# Altium schematic sheet supply.SchDoc
size 420 x 297 mm; SheetNumber: 4; SheetTotal: 5
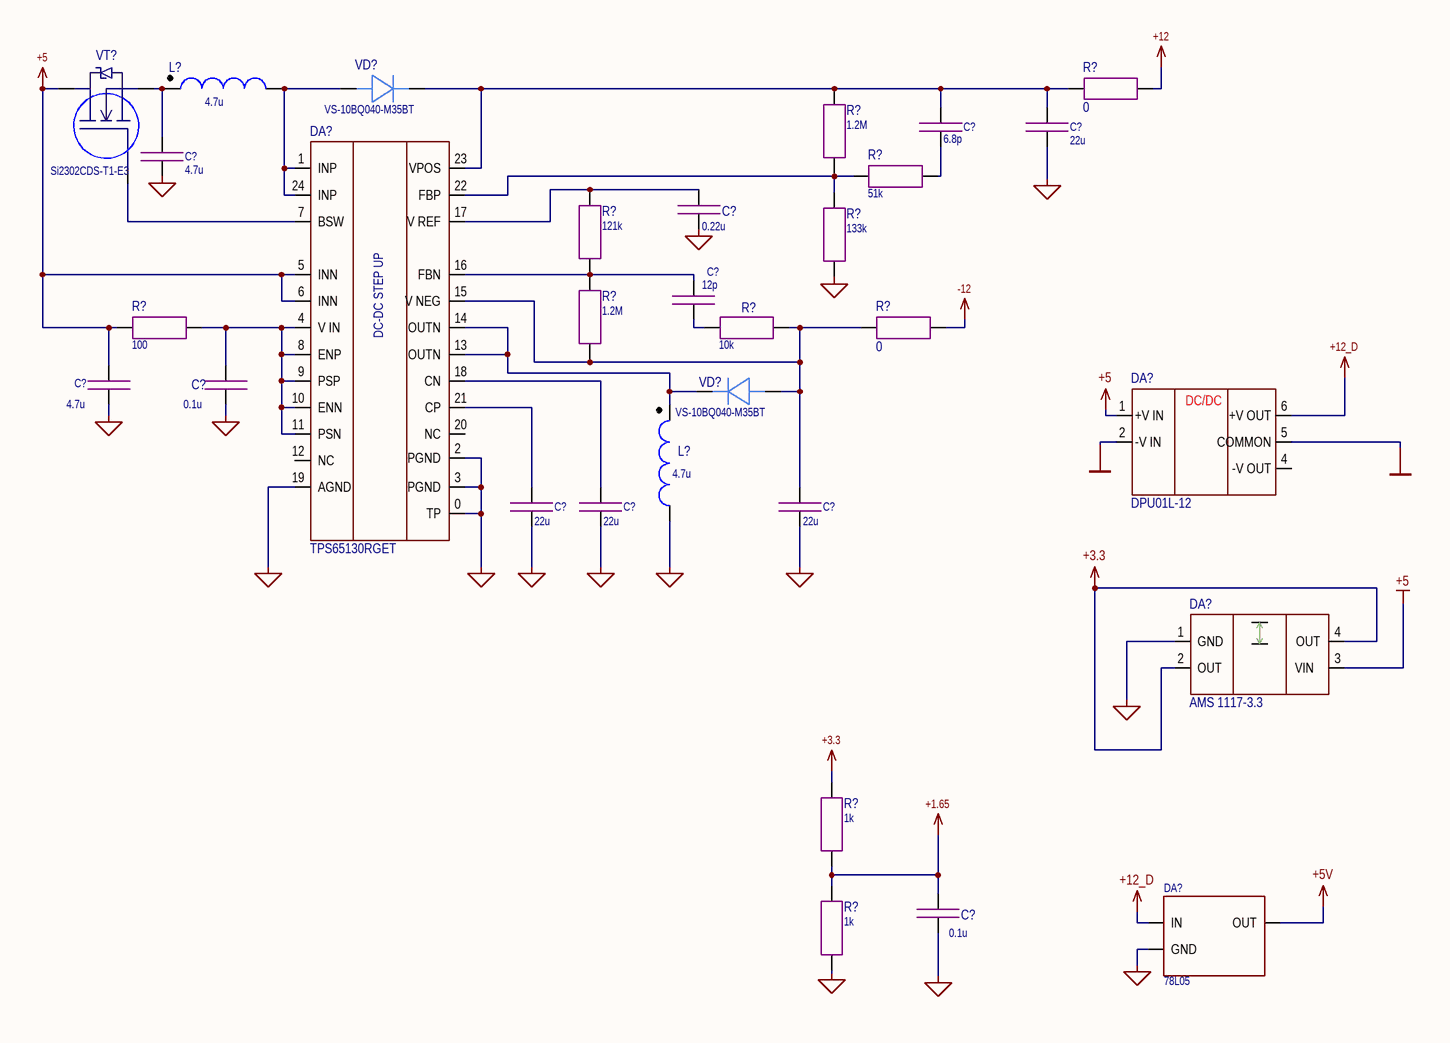
[diagram p0: supply.SchDoc]

## Parts
(Parts that share a designator on the sheet are numbered #1, #2 ... from top to bottom, then left to right.)
C?#1  6.8p  [CAP: SMD 0805 MD IPC 782]
C?#2  22u  [CAP: SMD 0805 MD IPC 782]
C?#3  4.7u  [CAP: SMD 0805 MD IPC 782]
C?#4  0.22u  [CAP: SMD 0805 MD IPC 782]
C?#5  12p  [CAP: SMD 0603 MD IPC 782]
C?#6  4.7u  [CAP: SMD 0805 MD IPC 782]
C?#7  0.1u  [CAP: SMD 0805 MD IPC 782]
C?#8  22u  [CAP: SMD 0805 MD IPC 782]
C?#9  22u  [CAP: SMD 0805 MD IPC 782]
C?#10  22u  [CAP: SMD 0805 MD IPC 782]
C?#11  0.1u  [CAP: SMD 0805 MD IPC 782]
DA?#1  TPS65130RGET  [IC: PVQFN 24]
DA?#2  DPU01L-12  [SIP-6]
DA?#3  AMS 1117-3.3  [IC: SOT 223]
DA?#4  78L05  [IC: SOT 89]
L?#1  4.7u  [IND: LPS5030]
L?#2  4.7u  [IND: LPS5030]
R?#1  0  [RES: SMD 0805 MD IPC 782]
R?#2  1.2M  [RES: SMD 0603 MD IPC 782]
R?#3  51k  [RES: SMD 0805 MD IPC 782]
R?#4  121k  [RES: SMD 0603 MD IPC 782]
R?#5  133k  [RES: SMD 0603 MD IPC 782]
R?#6  100  [RES: SMD 0805 MD IPC 782]
R?#7  10k  [RES: SMD 0805 MD IPC 782]
R?#8  0  [RES: SMD 0805 MD IPC 782]
R?#9  1.2M  [RES: SMD 0603 MD IPC 782]
R?#10  1k  [RES: SMD 0805 MD IPC 782]
R?#11  1k  [RES: SMD 0805 MD IPC 782]
VD?#1  VS-10BQ040-M35BT  [DIODE: SMB]
VD?#2  VS-10BQ040-M35BT  [DIODE: SMB]
VT?  Si2302CDS-T1-E3  [IC: SOT 23]

## Nets
+1.65: C?#11.1 R?#10.1 R?#11.2
+3.3: DA?#3.2(OUT) DA?#3.4(OUT) R?#10.2
+5: C?#6.1 DA?#1.5(INN) DA?#1.6(INN) DA?#2.1(+V_IN) DA?#3.3(VIN) R?#6.1 VT?.3
+5V: DA?#4.1(OUT)
+12: R?#1.2
+12_D: DA?#2.6(+V_OUT) DA?#4.3(IN)
-12: R?#8.2
GNDD: DA?#2.2(-V_IN) DA?#2.5(COMMON)
NetC?#2_2: C?#2.2 C?#3.2 C?#4.2 C?#6.2 C?#7.2 C?#8.2 C?#9.2 C?#10.2 C?#11.2 DA?#1.0(TP) DA?#1.2(PGND) DA?#1.3(PGND) DA?#1.19(AGND) DA?#3.1(GND) DA?#4.2(GND) L?#2.2 R?#5.1 R?#11.1
NetC?#1_1: C?#1.1 C?#2.1 DA?#1.23(VPOS) R?#1.1 R?#2.2 VD?#1.1
NetC?#1_2: C?#1.2 R?#3.2
NetC?#3_1: C?#3.1 L?#1.1 VT?.2
NetC?#4_1: C?#4.1 DA?#1.17(V_REF) R?#4.2
NetC?#5_1: C?#5.1 DA?#1.16(FBN) R?#4.1 R?#9.2
NetC?#5_2: C?#5.2 R?#7.1
NetC?#7_1: C?#7.1 DA?#1.4(V_IN) DA?#1.8(ENP) DA?#1.9(PSP) DA?#1.10(ENN) DA?#1.11(PSN) R?#6.2
NetC?#8_1: C?#8.1 DA?#1.21(CP)
NetC?#9_1: C?#9.1 DA?#1.18(CN)
NetC?#10_1: C?#10.1 DA?#1.15(V_NEG) R?#7.2 R?#8.1 R?#9.1 VD?#2.2
NetDA?#1_1: DA?#1.1(INP) DA?#1.24(INP) L?#1.2 VD?#1.2
NetDA?#1_7: DA?#1.7(BSW) VT?.1
NetDA?#1_13: DA?#1.13(OUTN) DA?#1.14(OUTN) L?#2.1 VD?#2.1
NetDA?#1_22: DA?#1.22(FBP) R?#2.1 R?#3.1 R?#5.2

Not connected (* = marked no-connect by the designer): DA?#1 12(NC) 20(NC); DA?#2 4(-V_OUT)

## Notes on the sheet
- Подп. и дата
- Инв. № дубл.
- Взам. инв. №
- Инв. № подл.
- Изм.
- Лист
- № докум.
- Подп.
- Дата
- 2.106-A3
- Копировал
- Формат А3
- (in symbol DC-DC: 3-15/-15V TPS65130RGET) DC-DC STEP UP
- (in symbol DC-DC: +12/-12V DPU01L-12) DC/DC

## Library data of the parts
C?#1 = 6.8p 50V 0805 ±5%: Code: 6219233221; Name: Конденсатор COG 16V 6.8pF±5% 0805
C?#2 C?#8-C?#10 = 22u 35V 0805 ±20%: Code: 6279375691; Name: Конденсатор X5R 35V 22uF±20% 0805
C?#3 C?#6 = 4.7u 25V 0805 ±10%: Code: 6270000501; Name: Конденсатор X7R 25V 4,7uF±10% 0805
C?#4 = 0.22u 50V 0805 ±10%: Name: Конденсатор 0805B224K500NT, Fenghua
C?#5 = 12p 50V 0603 ±5%: Code: 6279238291; Name: Конденсатор NP0 50V 12pF±5% 0603
C?#7 C?#11 = 0.1u 50V 0805 ±10%: Code: 6279254871; Name: Конденсатор X7R 50V 0,1uF ±10% 0805
DA?#1 = DC-DC: 3-15/-15V TPS65130RGET: Code: 6339113561; Name: Микросхема TPS65130RGET, TI
DA?#2 = DC-DC: +12/-12V DPU01L-12: Code: 6339113551; Name: Микросхема AM2D-0512DZ, AIMTEC
DA?#3 = LDO: 15-3.3V AMS1117: Code: 6339112951; Name: Микросхема AMS-1117-3.3
DA?#4 = 78L05: 78L05, Стабилизатор напряжения +5В 0.1А; P/N: Микросхема питания 78L05, UMW; ComponentLink1Description: Chipdip; ComponentLink1URL: https://www.chipdip.ru/product/78l05-stabilizator-napryazheniya-5v-0.1a-sot-89-umw-9001231082
L?#1 L?#2 = 4.7u±20% 2A: LPS5030; Code: 6339119781; Name: Микросхема LPS5030-472MR(B), Coilcraft
R?#1 R?#8 = 0 ±1% 0805: Code: 6094342239; Name: Резистор 0R ±1% 0805
R?#2 R?#9 = 1.2M ±1% 0603: Code: 6069194591; Name: Резистор 1,2M±1% ТК50 0603
R?#3 = 51k ±1% 0805: Code: 6094354057; Name: Резистор 51K±1% 0805
R?#4 = 121k ±1% 0603: Code: 6060001691; Name: Резистор 121K±1% 0603
R?#5 = 133k ±1% 0603: Code: 6027155891; Name: Резистор CRCW0603133KFKEA, Vishay
R?#6 = 100 ±1%  0805: Code: 6094351171; Name: Резистор 100R±1%  0805
R?#7 = 10k ±1% 0805: Code: 6020003061; Name: Резистор RC0805JR-0710KL
R?#10 R?#11 = 1k ±1% 0805: Code: 6027158691; Name: Резистор RC0805FR-071KL, Yageo
VD?#1 VD?#2 = Rectifier 1A 40V: Code: 6349982351; Name: Диод VS-10BQ040-M35BT, Vishay
VT? = MOS N Si2302CDS-T1-E3: Code: 6349982201; Name: Транзистор Si2302CDS-T1-E3,  Vishay